# Altium schematic sheet H-00488 - I2C Mux.SchDoc: 8-Port I2C Mux (TCA9548)
size 403 x 281 mm; DocumentNumber: 5; SheetNumber: 5; SheetTotal: 12
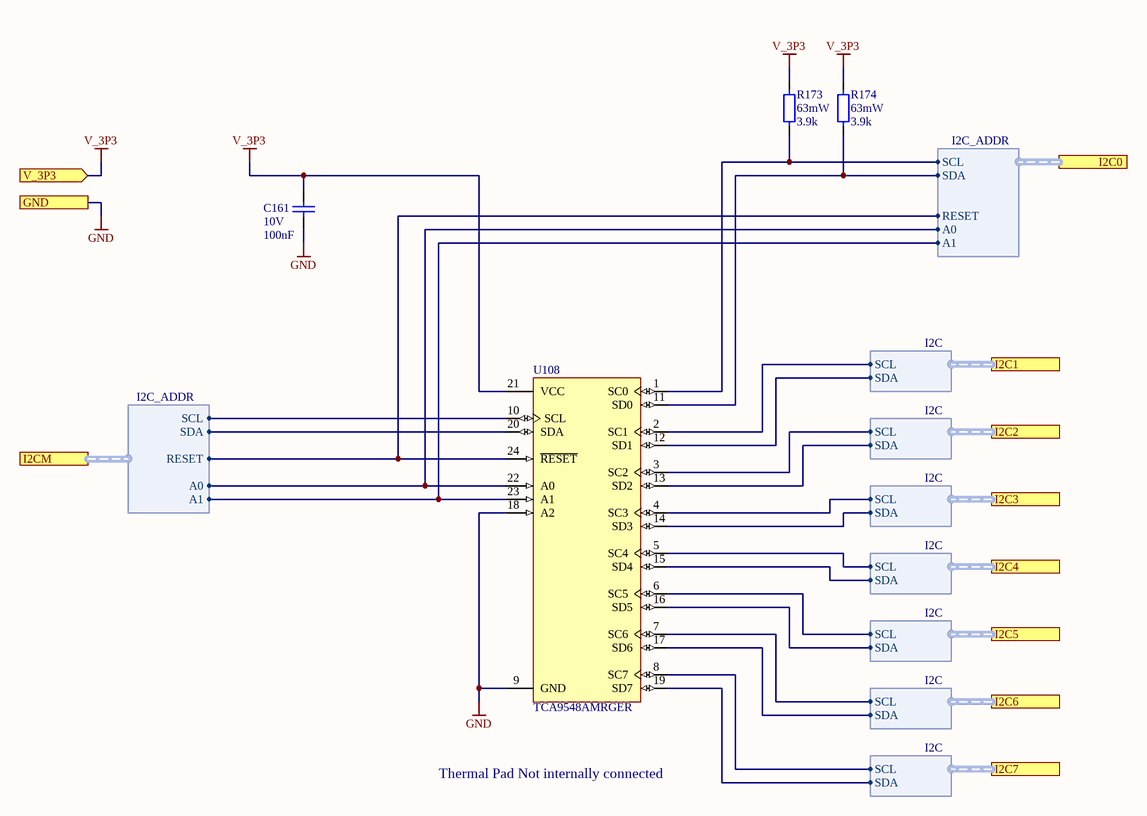
[diagram p0: H-00488 - I2C Mux.SchDoc]

## Parts
C161  value 100nF  Rated Voltage: 10V  [CAPC100X50X55L30N]  (hidden comment: C0402C104K8RACTU)
R173  value 3.9k  Rated Power: 63mW  [RESC100X50X40L25N]  (hidden comment: CRCW04023K90FKED)
R174  value 3.9k  Rated Power: 63mW  [RESC100X50X40L25N]  (hidden comment: CRCW04023K90FKED)
U108  TCA9548AMRGER  [QFN25P50_400X400X100L40X24T270]

## Ports
GND, I2C0 (harness I2C_ADDR), I2C1 (harness I2C), I2C2 (harness I2C), I2C3 (harness I2C), I2C4 (harness I2C), I2C5 (harness I2C), I2C6 (harness I2C), I2C7 (harness I2C), I2CM (harness I2C_ADDR), V_3P3 (in)

## Harnesses
I2C: SCL, SDA
I2C_ADDR: SDA, SCL, A0, A1, RESET

## Nets
GND: C161.2 U108.9(GND) U108.18(A2) ; port GND
V_3P3: C161.1 R173.2 R174.2 U108.21(VCC) ; port V_3P3
NetR173_1: R173.1 U108.1(SC0) ; port I2C0.SCL
NetR174_1: R174.1 U108.11(SD0) ; port I2C0.SDA
NetU108_2: U108.2(SC1) ; port I2C1.SCL
NetU108_3: U108.3(SC2) ; port I2C2.SCL
NetU108_4: U108.4(SC3) ; port I2C3.SCL
NetU108_5: U108.5(SC4) ; port I2C4.SCL
NetU108_6: U108.6(SC5) ; port I2C5.SCL
NetU108_7: U108.7(SC6) ; port I2C6.SCL
NetU108_8: U108.8(SC7) ; port I2C7.SCL
NetU108_10: U108.10(SCL) ; port I2CM.SCL
NetU108_12: U108.12(SD1) ; port I2C1.SDA
NetU108_13: U108.13(SD2) ; port I2C2.SDA
NetU108_14: U108.14(SD3) ; port I2C3.SDA
NetU108_15: U108.15(SD4) ; port I2C4.SDA
NetU108_16: U108.16(SD5) ; port I2C5.SDA
NetU108_17: U108.17(SD6) ; port I2C6.SDA
NetU108_19: U108.19(SD7) ; port I2C7.SDA
NetU108_20: U108.20(SDA) ; port I2CM.SDA
NetU108_22: U108.22(A0) ; port I2C0.A0, port I2CM.A0
NetU108_23: U108.23(A1) ; port I2C0.A1, port I2CM.A1
NetU108_24: U108.24(~{RESET}) ; port I2C0.RESET, port I2CM.RESET

## Notes on the sheet
- Thermal Pad Not internally connected
- PROJECT
- DESCRIPTION
- SIZE
- ENGINEER
- VARIANT
- A3
- TITLE
- MODIFIED
- RELEASE
- HIBER BV
  MOERMANSKKADE 600
  1013 BC, AMSTERDAM
  THE NETHERLANDS
- FILE NAME
- APPROVER
- SHEET
- APPROVED
- OF
- THIS DOCUMENT AND THE DATA DISCLOSED HEREIN OR HEREWITH IS THE PROPERTY OF HIBER INTERNATIONAL BV. IT CONTAINS CONFIDENTIAL AND PROPRIETARY INFORMATION THAT CANNOT BE REPRODUCED OR DIVULGED, IN WHOLE OR IN PART, WITHOUT WRITTEN AUTHORIZATION.

## Library data of the parts
C161 = CMP-00367-3: CAP Standard 0402 (1005) 100,0nF 10V X7R (Standard); Type: Ceramic; Tolerance: 10%; Termination Finish: 100% Matte Sn; Qualification: Standard; RoHS: Yes; Mount: SMT; Case/Package: 0402 (1005); Failure Rate: N/A; Pins: 2; Dielectric: X7R
R173 R174 = CMP-00284-8: RES Standard Thick Film 0402 3K90 ±1% 0,063W; Qualification: Automotive; Rated Voltage: 50V; Mount: Surface Mount; Termination Finish: Pure tin solder contacts on Ni barrier layer; Tolerance: 1%; Type: Standard Thick Film; Case/Package: 0402 (1005); Failure Rate: N/A; Pins: 2; RoHS: Yes
U108 = CMP-01089-1: Multiplexer, 9548 Series, 1-Func, 1 Line Input, 8 Line Output, True Output, PQCC24; Propagation Delay (tpd): 1ns; Number of Functions: 1; Supply Voltage-Nom (Vsup): 1.8V; Supply Voltage-Max (Vsup): 5.5V; Number of Outputs: 8; Supply Voltage-Min (Vsup): 1.65V; Package Body Material: Plastic; Height - Seated (Max): 1mm; Max Operating Temperature: 85°C; Surface Mount: Yes; Terminal Form: No Lead; Logic IC Type: MULTIPLEXER; Number of Pins: 24; Package Code: HVQCCN; Number of Inputs: 1; Moisture Sensitivity Level: 2; Temperature Grade: INDUSTRIAL; Terminal Position: QUAD; Output Polarity: True; Width: 4mm; Package Shape: Square; Terminal Pitch: 0.5mm; Min Operating Temperature: -40°C; JESD-609 Code: e4; Package Style: CHIP CARRIER, HEAT SINK/SLUG, VERY THIN PROFILEMeter; Terminal Finish: Nickel; Length: 4mm